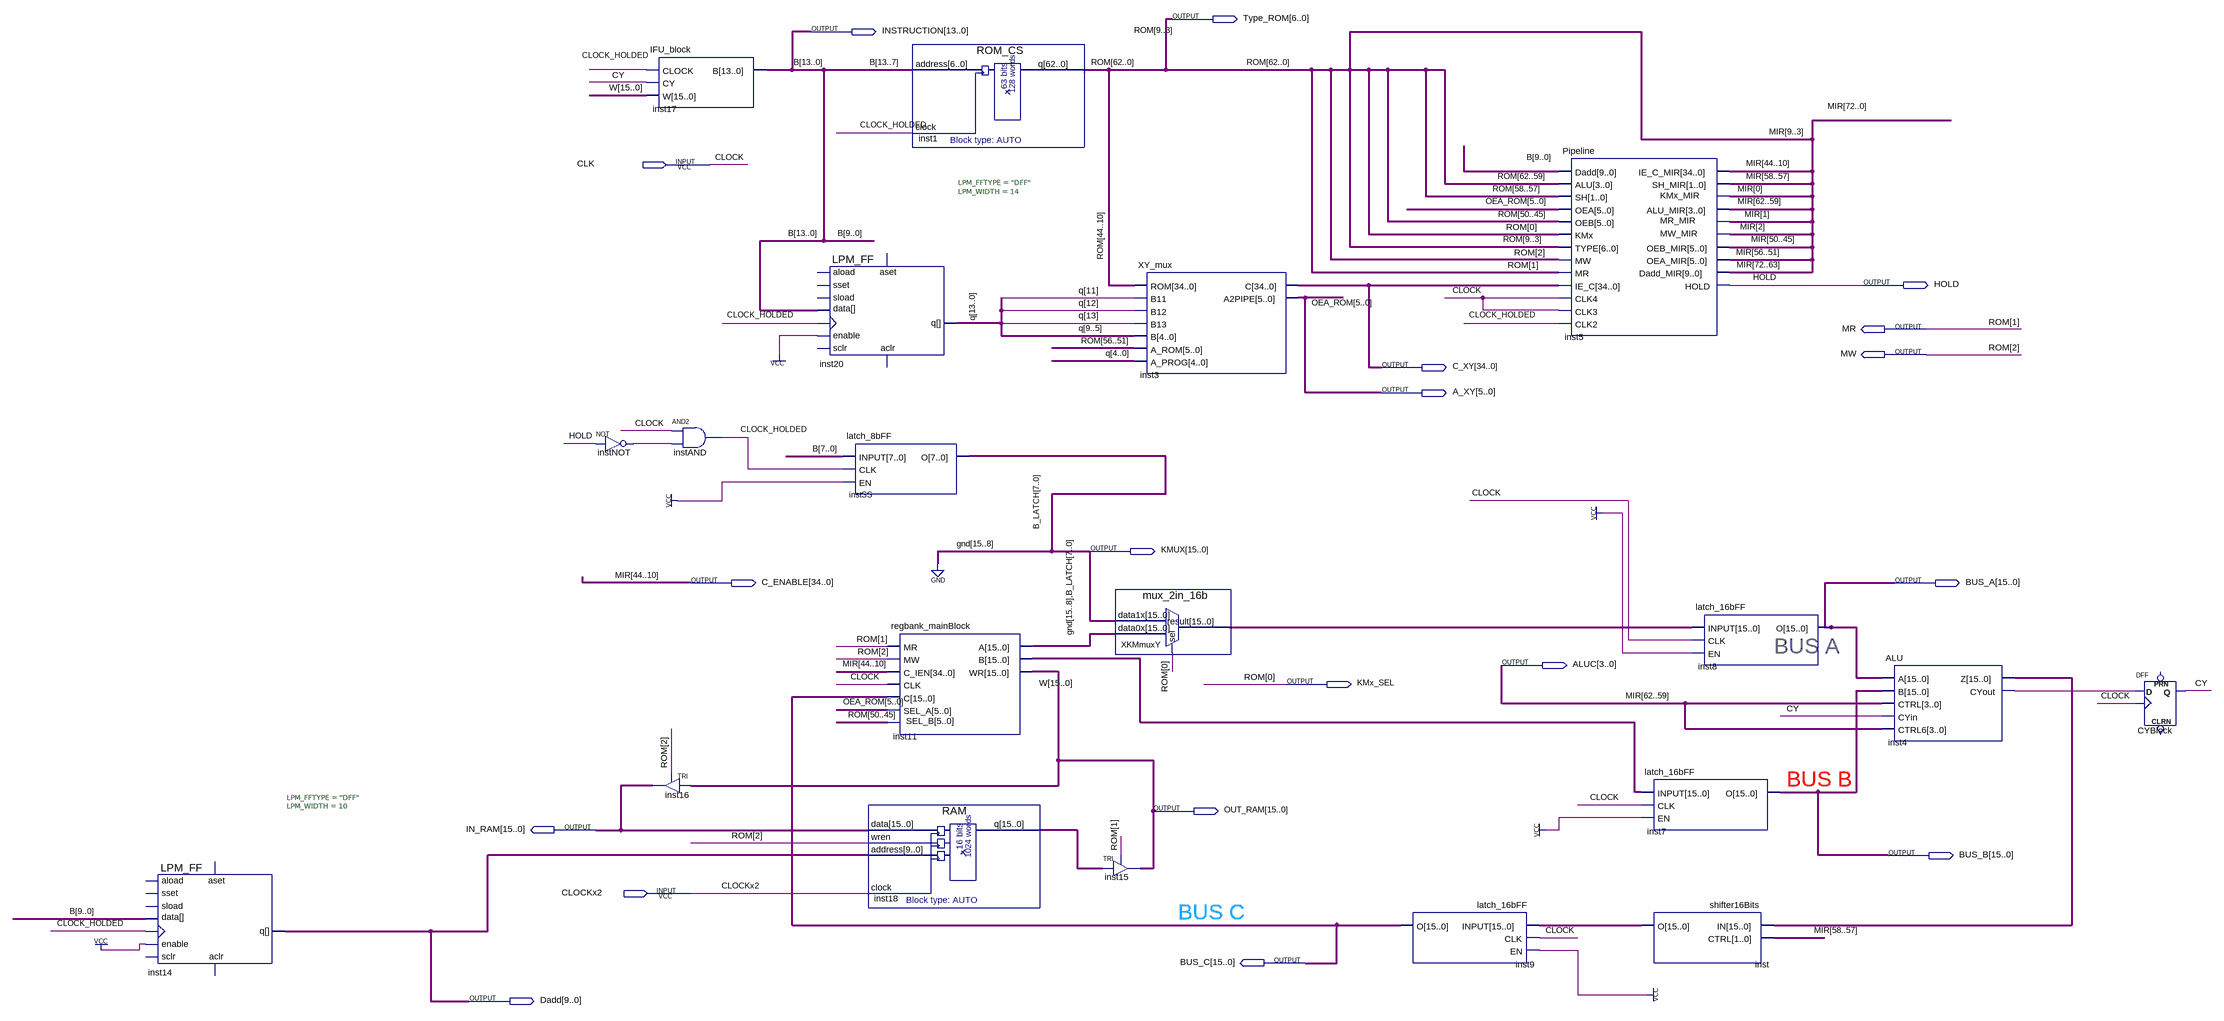
[diagram p0: schematic sheet]
// Quartus schematic main.bdf as structural Verilog: 20 symbols, 19 pins
module main (
  input  CLK,
  input  CLOCKx2,
  output [6:0] Type_ROM,
  output [13:0] INSTRUCTION,
  output HOLD,
  output MR,
  output MW,
  output [34:0] C_XY,
  output [5:0] A_XY,
  output [15:0] KMUX,
  output [34:0] C_ENABLE,
  output [15:0] BUS_A,
  output [3:0] ALUC,
  output KMx_SEL,
  output [15:0] OUT_RAM,
  output [15:0] IN_RAM,
  output [15:0] BUS_B,
  output [15:0] BUS_C,
  output [9:0] Dadd
);

  wire CLOCK_HOLDED, CY, inst4_cyout, instNOT_out;
  wire [13:0] q;
  wire [15:0] inst4_z, inst11_a, inst11_b, inst18_q, inst_o, XKMmuxY_result;
  wire [62:10] ROM;
  wire [72:0] MIR;

  LPM_FF #(.LPM_FFTYPE("DFF"), .LPM_WIDTH(10)) inst14 (
    .enable(1'b1), .clock(CLOCK_HOLDED), .data(INSTRUCTION[9:0]), .q(Dadd));  // open: aload, sset, sload, aset, sclr, aclr
  not instNOT (instNOT_out, HOLD);
  IFU_block inst17 (.CLOCK(CLOCK_HOLDED), .CY(CY), .W(OUT_RAM), .B(INSTRUCTION));
  and instAND (CLOCK_HOLDED, CLK, instNOT_out);
  TRI inst16[15:0] (.IN(OUT_RAM), .OE(MW), .OUT(IN_RAM));
  LPM_FF #(.LPM_FFTYPE("DFF"), .LPM_WIDTH(14)) inst20 (
    .enable(1'b1), .clock(CLOCK_HOLDED), .data(INSTRUCTION), .q(q));  // open: aload, sset, sload, aset, sclr, aclr
  latch_8bFF instSS (.INPUT(INSTRUCTION[7:0]), .CLK(CLOCK_HOLDED), .EN(1'b1), .O(KMUX[7:0]));
  regbank_mainBlock inst11 (
    .MR(MR), .MW(MW), .C_IEN(C_ENABLE), .CLK(CLK), .C(BUS_C), .SEL_A(A_XY), .SEL_B(ROM[50:45]), .A(inst11_a),
    .B(inst11_b), .WR(OUT_RAM));
  RAM inst18 (.data(IN_RAM), .wren(MW), .address(Dadd), .clock(CLOCKx2), .q(inst18_q));
  ROM_CS inst1 (.address(INSTRUCTION[13:7]), .clock(CLOCK_HOLDED), .q({ROM, Type_ROM, MW, MR, KMx_SEL}));
  XY_mux inst3 (
    .ROM(ROM[44:10]), .B11(q[11]), .B12(q[12]), .B13(q[13]), .B(q[9:5]), .A_ROM(ROM[56:51]), .A_PROG(q[4:0]),
    .C(C_XY), .A2PIPE(A_XY));
  mux_2in_16b XKMmuxY (.data1x({{8{1'b0}}, KMUX[7:0]}), .data0x(inst11_a), .sel(KMx_SEL), .result(XKMmuxY_result));
  TRI inst15[15:0] (.IN(inst18_q), .OE(MR), .OUT(OUT_RAM));
  latch_16bFF inst9 (.INPUT(inst_o), .CLK(CLK), .EN(1'b1), .O(BUS_C));
  Pipeline inst5 (
    .Dadd(INSTRUCTION[9:0]), .ALU(ROM[62:59]), .SH(ROM[58:57]), .OEA(A_XY), .OEB(ROM[50:45]),
    .TYPE(Type_ROM), .MW(MW), .MR(MR), .CLK2(CLOCK_HOLDED), .CLK4(CLK), .CLK3(CLK), .KMx(KMx_SEL),
    .IE_C(C_XY), .IE_C_MIR(C_ENABLE), .SH_MIR(MIR[58:57]), .ALU_MIR(ALUC), .OEB_MIR(MIR[50:45]),
    .OEA_MIR(MIR[56:51]), .Dadd_MIR(MIR[72:63]), .HOLD(HOLD), .MR_MIR(MIR[1]), .MW_MIR(MIR[2]),
    .KMx_MIR(MIR[0]));
  latch_16bFF inst7 (.INPUT(inst11_b), .CLK(CLK), .EN(1'b1), .O(BUS_B));
  shifter16Bits inst (.IN(inst4_z), .CTRL(MIR[58:57]), .O(inst_o));
  latch_16bFF inst8 (.INPUT(XKMmuxY_result), .CLK(CLK), .EN(1'b1), .O(BUS_A));
  ALU inst4 (.A(BUS_A), .B(BUS_B), .CTRL(ALUC), .CYin(CY), .CTRL6(ALUC), .Z(inst4_z), .CYout(inst4_cyout));
  DFF CYBlock (.CLK(CLK), .D(inst4_cyout), .Q(CY));  // open: CLRN, PRN

  assign KMUX[15:8] = {8{1'b0}};

  // Other names for the same wires on the sheet: OEA_ROM[5:0] = A_XY; MIR (some bits) = {ALUC, C_ENABLE};
  //   B[13:0] = INSTRUCTION; B_LATCH[7:0] = KMUX[7:0]; CLOCK = CLK; W[15:0] = OUT_RAM;
  //   ROM[9:0] = {Type_ROM, MW, MR, KMx_SEL}

  // Notes on the sheet:
  //   BUS A  
  //   BUS B
  //   BUS C  
endmodule
